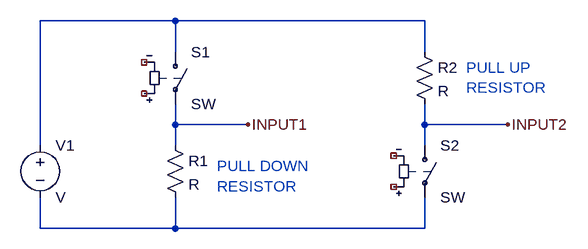
[diagram p0: schematic Button input.asc]
Button input.asc, the LTspice schematic file:
Version 4
SHEET 1 880 680
WIRE -208 96 -416 96
WIRE 176 96 -208 96
WIRE -208 144 -208 96
WIRE 176 144 176 96
WIRE -208 256 -208 224
WIRE -96 256 -208 256
WIRE 176 256 176 224
WIRE 304 256 176 256
WIRE -416 288 -416 96
WIRE -208 288 -208 256
WIRE 176 288 176 256
WIRE -416 416 -416 368
WIRE -208 416 -208 368
WIRE -208 416 -416 416
WIRE 176 416 176 368
WIRE 176 416 -208 416
FLAG 304 256 INPUT2
FLAG -96 256 INPUT1
SYMBOL sw -208 128 R0
SYMATTR InstName S1
SYMBOL sw 176 272 R0
SYMATTR InstName S2
SYMBOL voltage -416 272 R0
SYMATTR InstName V1
SYMBOL res -224 272 R0
SYMATTR InstName R1
SYMBOL res 160 128 R0
SYMATTR InstName R2
TEXT -144 320 Left 2 ;PULL DOWN\nRESISTOR
TEXT 240 168 Left 2 ;PULL UP\nRESISTOR

The netlist it stands for:
* Button input.asc
S1 N001 INPUT1 NC_01 NC_02 SW
S2 INPUT2 N002 NC_03 NC_04 SW
V1 N001 N002 V
R1 INPUT1 N002 R
R2 N001 INPUT2 R
* PULL DOWN
* RESISTOR
* PULL UP
* RESISTOR
.backanno
.end